# Altium schematic sheet MB1397_TOP.SchDoc: MB1397 TOP
size A3; Date: Not used; ApprovedBy: Not used; CheckedBy: Not used; Author: Not used; CompanyName: STMicroelectronics; DrawnBy: Not used; Engineer: Not used; Organization: Not used; Address1: Not used; Address2: Not used; Address3: Not used; Address4: Not used; DocumentNumber: Not used; Revision: Not used; SheetNumber: 2; SheetTotal: 22; CurrentTime: Not used; CurrentDate: Not used; Time: Not used; DocumentFullPathAndName: Not used; DocumentName: Not used; ModifiedDate: Not used; ImagePath: Not used; ProjectName: Not used; Application_BuildNumber: Not used
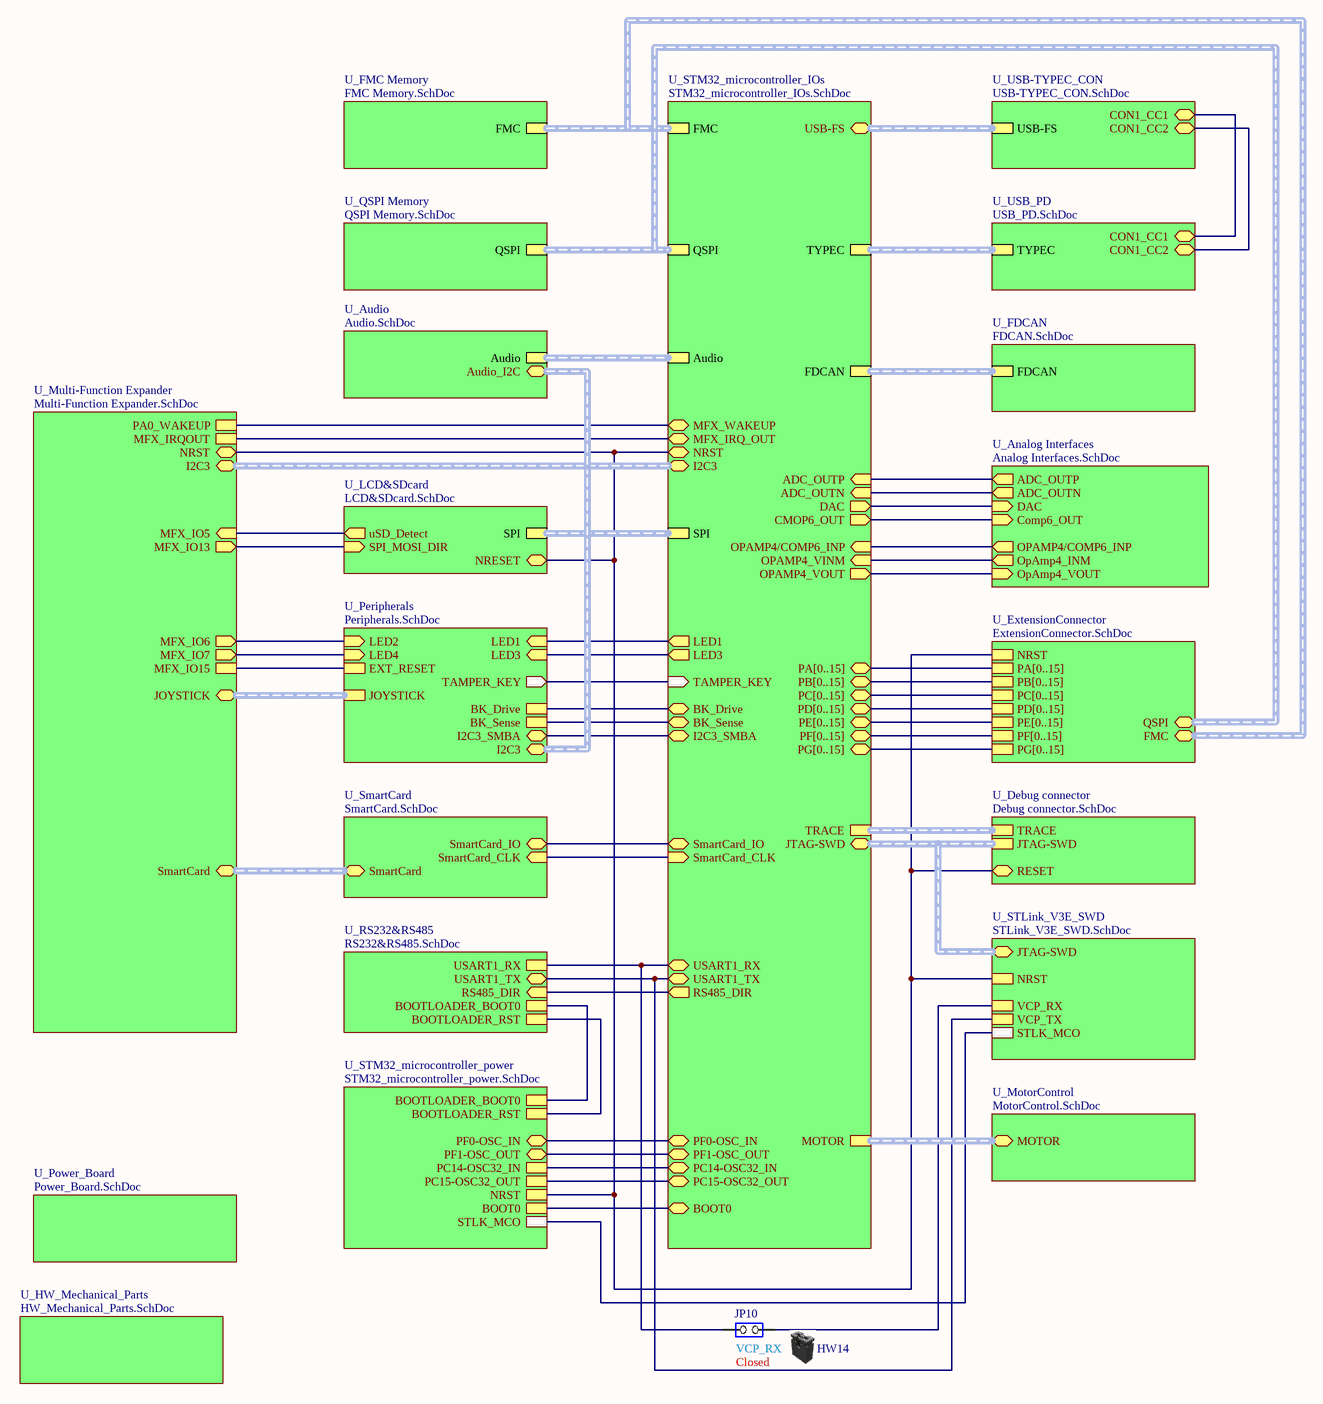
[diagram p0: MB1397_TOP.SchDoc]

## Parts
HW14  Shunt Black 2.54mm  (value not drawn)  (mechanical)
JP10  Jumper_Header 2x1  [CON_SAMTEC_TSW-102-07-G-S]  (value not drawn)

## Sub-sheets
U_Analog Interfaces = Analog Interfaces.SchDoc: ADC_OUTP (out), ADC_OUTN (out), Comp6_OUT (in), OpAmp4_INM (out), OpAmp4_VOUT (in), DAC (in), OPAMP4/COMP6_INP (out)
U_Audio = Audio.SchDoc: Audio (harness SAI), Audio_I2C (harness I2C3)
U_Debug connector = Debug connector.SchDoc: TRACE (harness TRACE), JTAG-SWD (harness JTAG-SWD), RESET
U_ExtensionConnector = ExtensionConnector.SchDoc: NRST, PA[0..15], PB[0..15], PC[0..15], PD[0..15], PE[0..15], PF[0..15], PG[0..15], QSPI (harness QSPI), FMC (harness FMC)
U_FDCAN = FDCAN.SchDoc: FDCAN (harness FDCAN)
U_FMC Memory = FMC Memory.SchDoc: FMC (harness FMC)
U_HW_Mechanical_Parts = HW_Mechanical_Parts.SchDoc: no entries
U_LCD&SDcard = LCD&SDcard.SchDoc: SPI (harness SPI), SPI_MOSI_DIR (in), uSD_Detect (out), NRESET
U_MotorControl = MotorControl.SchDoc: MOTOR (harness MOTOR)
U_Multi-Function Expander = Multi-Function Expander.SchDoc: MFX_IRQOUT, MFX_IO15, PA0_WAKEUP, JOYSTICK (harness JOYSTICK), SmartCard (harness SmartCard), I2C3 (harness I2C3), MFX_IO7 (out), MFX_IO6 (out), MFX_IO5 (in), MFX_IO13 (out), NRST
U_Peripherals = Peripherals.SchDoc: LED4 (in), LED3 (in), LED1 (in), LED2 (in), TAMPER_KEY (out), EXT_RESET, JOYSTICK (harness JOYSTICK), BK_Sense, BK_Drive, I2C3 (harness I2C3), I2C3_SMBA
U_Power_Board = Power_Board.SchDoc: no entries
U_QSPI Memory = QSPI Memory.SchDoc: QSPI (harness QSPI)
U_RS232&RS485 = RS232&RS485.SchDoc: BOOTLOADER_BOOT0, BOOTLOADER_RST, USART1_RX, USART1_TX, RS485_DIR (in)
U_SmartCard = SmartCard.SchDoc: SmartCard_IO (bidir), SmartCard_CLK (in), SmartCard (harness SmartCard)
U_STLink_V3E_SWD = STLink_V3E_SWD.SchDoc: NRST, VCP_TX, VCP_RX, STLK_MCO, JTAG-SWD (harness JTAG-SWD)
U_STM32_microcontroller_IOs = STM32_microcontroller_IOs.SchDoc: FMC (harness FMC), TAMPER_KEY (in), LED3 (out), LED1 (out), MOTOR (harness MOTOR), SPI (harness SPI), QSPI (harness QSPI), Audio (harness SAI), FDCAN (harness FDCAN), TYPEC (harness USB-TYPEC), TRACE (harness TRACE), SmartCard_IO (bidir), PF1-OSC_OUT, PC14-OSC32_IN, PC15-OSC32_OUT, I2C3 (harness I2C3), SmartCard_CLK (in), PF0-OSC_IN, BK_Drive, NRST, USB-FS (harness USB-FS), JTAG-SWD (harness JTAG-SWD), BOOT0, BK_Sense, DAC (out), PC[0..15], PB[0..15], PE[0..15], PF[0..15], PG[0..15], PA[0..15], PD[0..15], CMOP6_OUT (out), ADC_OUTN (in), OPAMP4_VOUT (out), ADC_OUTP (in), OPAMP4_VINM (in), OPAMP4/COMP6_INP (in), I2C3_SMBA, MFX_WAKEUP, MFX_IRQ_OUT, USART1_RX, USART1_TX, RS485_DIR (out)
U_STM32_microcontroller_power = STM32_microcontroller_power.SchDoc: BOOTLOADER_BOOT0, BOOTLOADER_RST, NRST, BOOT0, PC14-OSC32_IN, PC15-OSC32_OUT, STLK_MCO, PF0-OSC_IN, PF1-OSC_OUT
U_USB-TYPEC_CON = USB-TYPEC_CON.SchDoc: USB-FS (harness USB-FS), CON1_CC1, CON1_CC2
U_USB_PD = USB_PD.SchDoc: TYPEC (harness USB-TYPEC), CON1_CC2, CON1_CC1

## Nets
NetJP10_1: JP10.1(COMMON) ; sheet U_STLink_V3E_SWD/VCP_RX
NetJP10_2: JP10.2(NO) ; sheet U_STM32_microcontroller_IOs/USART1_RX, sheet U_RS232&RS485/USART1_RX
(unnamed): sheet U_STM32_microcontroller_IOs/TAMPER_KEY, sheet U_Peripherals/TAMPER_KEY
(unnamed): sheet U_STM32_microcontroller_IOs/LED3, sheet U_Peripherals/LED3
(unnamed): sheet U_STM32_microcontroller_IOs/LED1, sheet U_Peripherals/LED1
(unnamed): sheet U_STM32_microcontroller_IOs/SmartCard_IO, sheet U_SmartCard/SmartCard_IO
(unnamed): sheet U_STM32_microcontroller_IOs/PF1-OSC_OUT, sheet U_STM32_microcontroller_power/PF1-OSC_OUT
(unnamed): sheet U_STM32_microcontroller_IOs/PC14-OSC32_IN, sheet U_STM32_microcontroller_power/PC14-OSC32_IN
(unnamed): sheet U_STM32_microcontroller_IOs/PC15-OSC32_OUT, sheet U_STM32_microcontroller_power/PC15-OSC32_OUT
(unnamed): sheet U_STM32_microcontroller_IOs/SmartCard_CLK, sheet U_SmartCard/SmartCard_CLK
(unnamed): sheet U_STM32_microcontroller_IOs/PF0-OSC_IN, sheet U_STM32_microcontroller_power/PF0-OSC_IN
(unnamed): sheet U_STM32_microcontroller_IOs/BK_Drive, sheet U_Peripherals/BK_Drive
(unnamed): sheet U_STM32_microcontroller_IOs/NRST, sheet U_LCD&SDcard/NRESET, sheet U_STM32_microcontroller_power/NRST, sheet U_Multi-Function Expander/NRST, sheet U_STLink_V3E_SWD/NRST, sheet U_ExtensionConnector/NRST, sheet U_Debug connector/RESET
(unnamed): sheet U_STM32_microcontroller_IOs/BOOT0, sheet U_STM32_microcontroller_power/BOOT0
(unnamed): sheet U_STM32_microcontroller_IOs/BK_Sense, sheet U_Peripherals/BK_Sense
(unnamed): sheet U_STM32_microcontroller_IOs/DAC, sheet U_Analog Interfaces/DAC
(unnamed): sheet U_STM32_microcontroller_IOs/CMOP6_OUT, sheet U_Analog Interfaces/Comp6_OUT
(unnamed): sheet U_STM32_microcontroller_IOs/ADC_OUTN, sheet U_Analog Interfaces/ADC_OUTN
(unnamed): sheet U_STM32_microcontroller_IOs/OPAMP4_VOUT, sheet U_Analog Interfaces/OpAmp4_VOUT
(unnamed): sheet U_STM32_microcontroller_IOs/ADC_OUTP, sheet U_Analog Interfaces/ADC_OUTP
(unnamed): sheet U_STM32_microcontroller_IOs/OPAMP4_VINM, sheet U_Analog Interfaces/OpAmp4_INM
(unnamed): sheet U_STM32_microcontroller_IOs/OPAMP4/COMP6_INP, sheet U_Analog Interfaces/OPAMP4/COMP6_INP
(unnamed): sheet U_STM32_microcontroller_IOs/I2C3_SMBA, sheet U_Peripherals/I2C3_SMBA
(unnamed): sheet U_STM32_microcontroller_IOs/MFX_WAKEUP, sheet U_Multi-Function Expander/PA0_WAKEUP
(unnamed): sheet U_STM32_microcontroller_IOs/MFX_IRQ_OUT, sheet U_Multi-Function Expander/MFX_IRQOUT
(unnamed): sheet U_STM32_microcontroller_IOs/USART1_TX, sheet U_STLink_V3E_SWD/VCP_TX, sheet U_RS232&RS485/USART1_TX
(unnamed): sheet U_STM32_microcontroller_IOs/RS485_DIR, sheet U_RS232&RS485/RS485_DIR
(unnamed): sheet U_LCD&SDcard/SPI_MOSI_DIR, sheet U_Multi-Function Expander/MFX_IO13
(unnamed): sheet U_LCD&SDcard/uSD_Detect, sheet U_Multi-Function Expander/MFX_IO5
(unnamed): sheet U_STM32_microcontroller_power/BOOTLOADER_BOOT0, sheet U_RS232&RS485/BOOTLOADER_BOOT0
(unnamed): sheet U_STM32_microcontroller_power/BOOTLOADER_RST, sheet U_RS232&RS485/BOOTLOADER_RST
(unnamed): sheet U_STM32_microcontroller_power/STLK_MCO, sheet U_STLink_V3E_SWD/STLK_MCO
(unnamed): sheet U_Multi-Function Expander/MFX_IO15, sheet U_Peripherals/EXT_RESET
(unnamed): sheet U_Multi-Function Expander/MFX_IO7, sheet U_Peripherals/LED4
(unnamed): sheet U_Multi-Function Expander/MFX_IO6, sheet U_Peripherals/LED2
(unnamed): sheet U_USB_PD/CON1_CC2, sheet U_USB-TYPEC_CON/CON1_CC2
(unnamed): sheet U_USB_PD/CON1_CC1, sheet U_USB-TYPEC_CON/CON1_CC1

## Buses and harness runs
bus sheet U_ExtensionConnector/PA[0..15] = sheet U_STM32_microcontroller_IOs/PA[0..15]
bus sheet U_ExtensionConnector/PB[0..15] = sheet U_STM32_microcontroller_IOs/PB[0..15]
bus sheet U_ExtensionConnector/PC[0..15] = sheet U_STM32_microcontroller_IOs/PC[0..15]
bus sheet U_ExtensionConnector/PD[0..15] = sheet U_STM32_microcontroller_IOs/PD[0..15]
bus sheet U_ExtensionConnector/PE[0..15] = sheet U_STM32_microcontroller_IOs/PE[0..15]
bus sheet U_ExtensionConnector/PF[0..15] = sheet U_STM32_microcontroller_IOs/PF[0..15]
bus sheet U_ExtensionConnector/PG[0..15] = sheet U_STM32_microcontroller_IOs/PG[0..15]
harness sheet U_Audio/Audio = sheet U_STM32_microcontroller_IOs/Audio
harness sheet U_Audio/Audio_I2C = sheet U_Multi-Function Expander/I2C3 = sheet U_Peripherals/I2C3 = sheet U_STM32_microcontroller_IOs/I2C3
harness sheet U_Debug connector/JTAG-SWD = sheet U_STLink_V3E_SWD/JTAG-SWD = sheet U_STM32_microcontroller_IOs/JTAG-SWD
harness sheet U_Debug connector/TRACE = sheet U_STM32_microcontroller_IOs/TRACE
harness sheet U_ExtensionConnector/FMC = sheet U_FMC Memory/FMC = sheet U_STM32_microcontroller_IOs/FMC
harness sheet U_ExtensionConnector/QSPI = sheet U_QSPI Memory/QSPI = sheet U_STM32_microcontroller_IOs/QSPI
harness sheet U_FDCAN/FDCAN = sheet U_STM32_microcontroller_IOs/FDCAN
harness sheet U_LCD&SDcard/SPI = sheet U_STM32_microcontroller_IOs/SPI
harness sheet U_MotorControl/MOTOR = sheet U_STM32_microcontroller_IOs/MOTOR
harness sheet U_Multi-Function Expander/JOYSTICK = sheet U_Peripherals/JOYSTICK
harness sheet U_Multi-Function Expander/SmartCard = sheet U_SmartCard/SmartCard
harness sheet U_STM32_microcontroller_IOs/TYPEC = sheet U_USB_PD/TYPEC
harness sheet U_STM32_microcontroller_IOs/USB-FS = sheet U_USB-TYPEC_CON/USB-FS

## Notes on the sheet
- Closed
- VCP_RX
- Title:
- Project:
- Size:
- Revision:
- Variant:
- A3
- -
- Date:
- Reference:
- Sheet:
- of

## Library data of the parts
HW14 = MCD-00043: SHUNT 2.54mm BLACK; Part_Type: Mechanical; Manufacturer_Part_Number: SNT-100-BK-G; Manufacturer: SAMTEC; Provided_By: SUBCO; Initial_Board_Reference: MB1274; Value: SNT-100-BK-G; Path: ws/MCD_ApplicationBoards/Lists/MCDPARTSdatabase; Item Type: Item; Internal_Part_Number: MCD-00043; Status: Released; ComponentLink1Description: Datasheet; ComponentLink1URL: http://tunmcdsvn.tun.st.com/Component_Datasheet_Library/Trunk/Connectors/Samtec_Shunt_Jumper_SNT100
JP10 = MCD-00045: Header, 2x1, 2,54mm, VR, TH, Height 5.84mm/2.54mm; Manufacturer_Part_Number: TSW-102-07-x-S; Manufacturer: SAMTEC; Part_Type: Connector; Value: Shunt not fitted; Provided_By: SUBCO; Initial_Board_Reference: MB1274; Path: ws/MCD_ApplicationBoards/Lists/MCDPARTSdatabase; Item Type: Item; Internal_Part_Number: MCD-00045; ComponentLink1Description: Datasheet; Status: Released; ComponentLink1URL: http://tunmcdsvn.tun.st.com/Component_Datasheet_Library/Trunk/Connectors/Samtec_TSW-HTSW-series